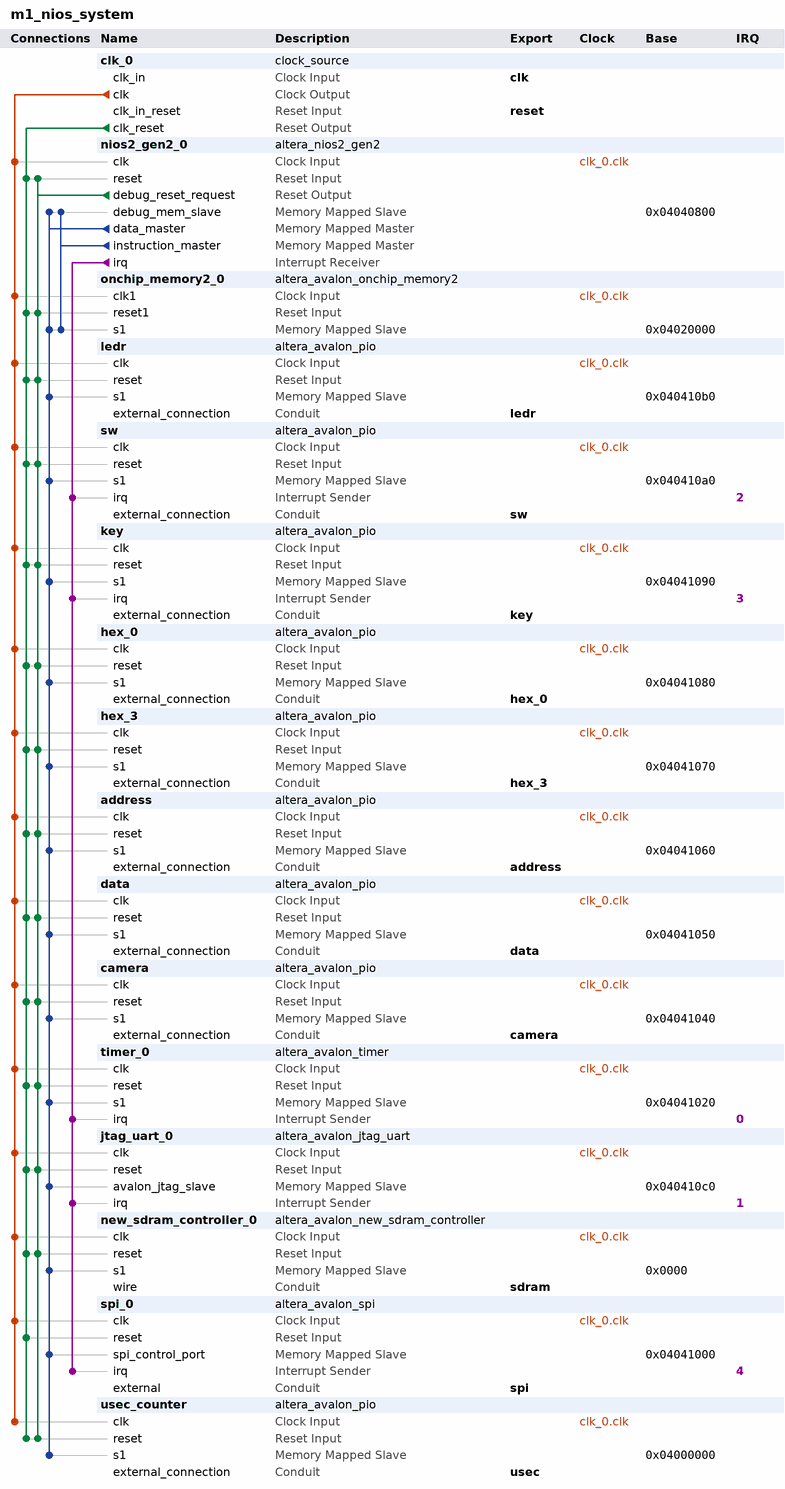
[diagram p0: system contents]
# Platform Designer (Qsys) system m1_nios_system, MAX 10 10M50DAF484C7G
# Parameters at their usual value, and those the tool derives, are not listed.
package require -exact qsys 18.1
create_system m1_nios_system
set_project_property DEVICE_FAMILY {MAX 10}
set_project_property DEVICE 10M50DAF484C7G

add_instance clk_0 clock_source 18.1
set_instance_parameter_value clk_0 clockFrequency 50000000

add_instance nios2_gen2_0 altera_nios2_gen2 18.1
set_instance_parameter_value nios2_gen2_0 dcache_size 2048
set_instance_parameter_value nios2_gen2_0 exceptionSlave onchip_memory2_0.s1
set_instance_parameter_value nios2_gen2_0 icache_size 4096
set_instance_parameter_value nios2_gen2_0 impl Fast
set_instance_parameter_value nios2_gen2_0 resetSlave onchip_memory2_0.s1

add_instance onchip_memory2_0 altera_avalon_onchip_memory2 18.1
set_instance_parameter_value onchip_memory2_0 dataWidth 32
set_instance_parameter_value onchip_memory2_0 dualPort false
set_instance_parameter_value onchip_memory2_0 initMemContent false
set_instance_parameter_value onchip_memory2_0 initializationFileName onchip_mem.hex
set_instance_parameter_value onchip_memory2_0 memorySize 100000

add_instance ledr altera_avalon_pio 18.1
set_instance_parameter_value ledr direction Output
set_instance_parameter_value ledr width 10

add_instance sw altera_avalon_pio 18.1
set_instance_parameter_value sw captureEdge true
set_instance_parameter_value sw direction Input
set_instance_parameter_value sw generateIRQ true
set_instance_parameter_value sw irqType EDGE
set_instance_parameter_value sw width 10

add_instance key altera_avalon_pio 18.1
set_instance_parameter_value key captureEdge true
set_instance_parameter_value key direction Input
set_instance_parameter_value key generateIRQ true
set_instance_parameter_value key irqType EDGE
set_instance_parameter_value key width 2

add_instance hex_0 altera_avalon_pio 18.1
set_instance_parameter_value hex_0 direction Output
set_instance_parameter_value hex_0 width 24

add_instance hex_3 altera_avalon_pio 18.1
set_instance_parameter_value hex_3 direction Output
set_instance_parameter_value hex_3 width 24

add_instance address altera_avalon_pio 18.1
set_instance_parameter_value address direction Output
set_instance_parameter_value address width 17

add_instance data altera_avalon_pio 18.1
set_instance_parameter_value data direction Output
set_instance_parameter_value data width 4

add_instance camera altera_avalon_pio 18.1
set_instance_parameter_value camera direction Input
set_instance_parameter_value camera width 1

add_instance timer_0 altera_avalon_timer 18.1
set_instance_parameter_value timer_0 period 1
set_instance_parameter_value timer_0 periodUnits MSEC

add_instance jtag_uart_0 altera_avalon_jtag_uart 18.1
set_instance_parameter_value jtag_uart_0 simInteractiveOptions NO_INTERACTIVE_WINDOWS

add_instance new_sdram_controller_0 altera_avalon_new_sdram_controller 18.1
set_instance_parameter_value new_sdram_controller_0 TAC 5.5
set_instance_parameter_value new_sdram_controller_0 TRCD 20.0
set_instance_parameter_value new_sdram_controller_0 TRP 20.0
set_instance_parameter_value new_sdram_controller_0 casLatency 3
set_instance_parameter_value new_sdram_controller_0 columnWidth 10
set_instance_parameter_value new_sdram_controller_0 dataWidth 16
set_instance_parameter_value new_sdram_controller_0 generateSimulationModel false
set_instance_parameter_value new_sdram_controller_0 model single_Micron_MT48LC4M32B2_7_chip
set_instance_parameter_value new_sdram_controller_0 numberOfBanks 4
set_instance_parameter_value new_sdram_controller_0 numberOfChipSelects 1
set_instance_parameter_value new_sdram_controller_0 powerUpDelay 100.0
set_instance_parameter_value new_sdram_controller_0 refreshPeriod 15.625
set_instance_parameter_value new_sdram_controller_0 rowWidth 13

add_instance spi_0 altera_avalon_spi 18.1
set_instance_parameter_value spi_0 clockPhase 1
set_instance_parameter_value spi_0 clockPolarity 1
set_instance_parameter_value spi_0 dataWidth 8
set_instance_parameter_value spi_0 masterSPI true
set_instance_parameter_value spi_0 numberOfSlaves 1
set_instance_parameter_value spi_0 targetClockRate 5000000

add_instance usec_counter altera_avalon_pio 18.1
set_instance_parameter_value usec_counter direction Input
set_instance_parameter_value usec_counter width 32

# connections
add_connection clk_0.clk address.clk clock
add_connection clk_0.clk camera.clk clock
add_connection clk_0.clk data.clk clock
add_connection clk_0.clk hex_0.clk clock
add_connection clk_0.clk hex_3.clk clock
add_connection clk_0.clk jtag_uart_0.clk clock
add_connection clk_0.clk key.clk clock
add_connection clk_0.clk ledr.clk clock
add_connection clk_0.clk new_sdram_controller_0.clk clock
add_connection clk_0.clk nios2_gen2_0.clk clock
add_connection clk_0.clk onchip_memory2_0.clk1 clock
add_connection clk_0.clk spi_0.clk clock
add_connection clk_0.clk sw.clk clock
add_connection clk_0.clk timer_0.clk clock
add_connection clk_0.clk usec_counter.clk clock
add_connection clk_0.clk_reset address.reset reset
add_connection clk_0.clk_reset camera.reset reset
add_connection clk_0.clk_reset data.reset reset
add_connection clk_0.clk_reset hex_0.reset reset
add_connection clk_0.clk_reset hex_3.reset reset
add_connection clk_0.clk_reset jtag_uart_0.reset reset
add_connection clk_0.clk_reset key.reset reset
add_connection clk_0.clk_reset ledr.reset reset
add_connection clk_0.clk_reset new_sdram_controller_0.reset reset
add_connection clk_0.clk_reset nios2_gen2_0.reset reset
add_connection clk_0.clk_reset onchip_memory2_0.reset1 reset
add_connection clk_0.clk_reset spi_0.reset reset
add_connection clk_0.clk_reset sw.reset reset
add_connection clk_0.clk_reset timer_0.reset reset
add_connection clk_0.clk_reset usec_counter.reset reset
add_connection nios2_gen2_0.debug_reset_request address.reset reset
add_connection nios2_gen2_0.debug_reset_request camera.reset reset
add_connection nios2_gen2_0.debug_reset_request data.reset reset
add_connection nios2_gen2_0.debug_reset_request hex_0.reset reset
add_connection nios2_gen2_0.debug_reset_request hex_3.reset reset
add_connection nios2_gen2_0.debug_reset_request jtag_uart_0.reset reset
add_connection nios2_gen2_0.debug_reset_request key.reset reset
add_connection nios2_gen2_0.debug_reset_request ledr.reset reset
add_connection nios2_gen2_0.debug_reset_request new_sdram_controller_0.reset reset
add_connection nios2_gen2_0.debug_reset_request nios2_gen2_0.reset reset
add_connection nios2_gen2_0.debug_reset_request onchip_memory2_0.reset1 reset
add_connection nios2_gen2_0.debug_reset_request sw.reset reset
add_connection nios2_gen2_0.debug_reset_request timer_0.reset reset
add_connection nios2_gen2_0.debug_reset_request usec_counter.reset reset
add_connection nios2_gen2_0.data_master address.s1 avalon
set_connection_parameter_value nios2_gen2_0.data_master/address.s1 baseAddress 0x04041060
add_connection nios2_gen2_0.data_master camera.s1 avalon
set_connection_parameter_value nios2_gen2_0.data_master/camera.s1 baseAddress 0x04041040
add_connection nios2_gen2_0.data_master data.s1 avalon
set_connection_parameter_value nios2_gen2_0.data_master/data.s1 baseAddress 0x04041050
add_connection nios2_gen2_0.data_master hex_0.s1 avalon
set_connection_parameter_value nios2_gen2_0.data_master/hex_0.s1 baseAddress 0x04041080
add_connection nios2_gen2_0.data_master hex_3.s1 avalon
set_connection_parameter_value nios2_gen2_0.data_master/hex_3.s1 baseAddress 0x04041070
add_connection nios2_gen2_0.data_master jtag_uart_0.avalon_jtag_slave avalon
set_connection_parameter_value nios2_gen2_0.data_master/jtag_uart_0.avalon_jtag_slave baseAddress 0x040410c0
add_connection nios2_gen2_0.data_master key.s1 avalon
set_connection_parameter_value nios2_gen2_0.data_master/key.s1 baseAddress 0x04041090
add_connection nios2_gen2_0.data_master ledr.s1 avalon
set_connection_parameter_value nios2_gen2_0.data_master/ledr.s1 baseAddress 0x040410b0
add_connection nios2_gen2_0.data_master new_sdram_controller_0.s1 avalon
set_connection_parameter_value nios2_gen2_0.data_master/new_sdram_controller_0.s1 baseAddress 0x0000
add_connection nios2_gen2_0.data_master nios2_gen2_0.debug_mem_slave avalon
set_connection_parameter_value nios2_gen2_0.data_master/nios2_gen2_0.debug_mem_slave baseAddress 0x04040800
add_connection nios2_gen2_0.data_master onchip_memory2_0.s1 avalon
set_connection_parameter_value nios2_gen2_0.data_master/onchip_memory2_0.s1 baseAddress 0x04020000
add_connection nios2_gen2_0.data_master spi_0.spi_control_port avalon
set_connection_parameter_value nios2_gen2_0.data_master/spi_0.spi_control_port baseAddress 0x04041000
add_connection nios2_gen2_0.data_master sw.s1 avalon
set_connection_parameter_value nios2_gen2_0.data_master/sw.s1 baseAddress 0x040410a0
add_connection nios2_gen2_0.data_master timer_0.s1 avalon
set_connection_parameter_value nios2_gen2_0.data_master/timer_0.s1 baseAddress 0x04041020
add_connection nios2_gen2_0.data_master usec_counter.s1 avalon
set_connection_parameter_value nios2_gen2_0.data_master/usec_counter.s1 baseAddress 0x04000000
add_connection nios2_gen2_0.instruction_master nios2_gen2_0.debug_mem_slave avalon
set_connection_parameter_value nios2_gen2_0.instruction_master/nios2_gen2_0.debug_mem_slave baseAddress 0x04040800
add_connection nios2_gen2_0.instruction_master onchip_memory2_0.s1 avalon
set_connection_parameter_value nios2_gen2_0.instruction_master/onchip_memory2_0.s1 baseAddress 0x04020000
add_connection nios2_gen2_0.irq jtag_uart_0.irq interrupt
set_connection_parameter_value nios2_gen2_0.irq/jtag_uart_0.irq irqNumber 1
add_connection nios2_gen2_0.irq key.irq interrupt
set_connection_parameter_value nios2_gen2_0.irq/key.irq irqNumber 3
add_connection nios2_gen2_0.irq spi_0.irq interrupt
set_connection_parameter_value nios2_gen2_0.irq/spi_0.irq irqNumber 4
add_connection nios2_gen2_0.irq sw.irq interrupt
set_connection_parameter_value nios2_gen2_0.irq/sw.irq irqNumber 2
add_connection nios2_gen2_0.irq timer_0.irq interrupt
set_connection_parameter_value nios2_gen2_0.irq/timer_0.irq irqNumber 0

# exported interfaces
add_interface address conduit end
set_interface_property address EXPORT_OF address.external_connection
add_interface camera conduit end
set_interface_property camera EXPORT_OF camera.external_connection
add_interface clk clock sink
set_interface_property clk EXPORT_OF clk_0.clk_in
add_interface data conduit end
set_interface_property data EXPORT_OF data.external_connection
add_interface hex_0 conduit end
set_interface_property hex_0 EXPORT_OF hex_0.external_connection
add_interface hex_3 conduit end
set_interface_property hex_3 EXPORT_OF hex_3.external_connection
add_interface key conduit end
set_interface_property key EXPORT_OF key.external_connection
add_interface ledr conduit end
set_interface_property ledr EXPORT_OF ledr.external_connection
add_interface reset reset sink
set_interface_property reset EXPORT_OF clk_0.clk_in_reset
add_interface sdram conduit end
set_interface_property sdram EXPORT_OF new_sdram_controller_0.wire
add_interface spi conduit end
set_interface_property spi EXPORT_OF spi_0.external
add_interface sw conduit end
set_interface_property sw EXPORT_OF sw.external_connection
add_interface usec conduit end
set_interface_property usec EXPORT_OF usec_counter.external_connection

set_interconnect_requirement {$system} qsys_mm.clockCrossingAdapter HANDSHAKE
set_interconnect_requirement {$system} qsys_mm.enableEccProtection FALSE
set_interconnect_requirement {$system} qsys_mm.insertDefaultSlave FALSE
set_interconnect_requirement {$system} qsys_mm.maxAdditionalLatency 1

save_system m1_nios_system.qsys
